# EAGLE design 7-jack-sensor-board-nano (EAGLE 9.6.2)
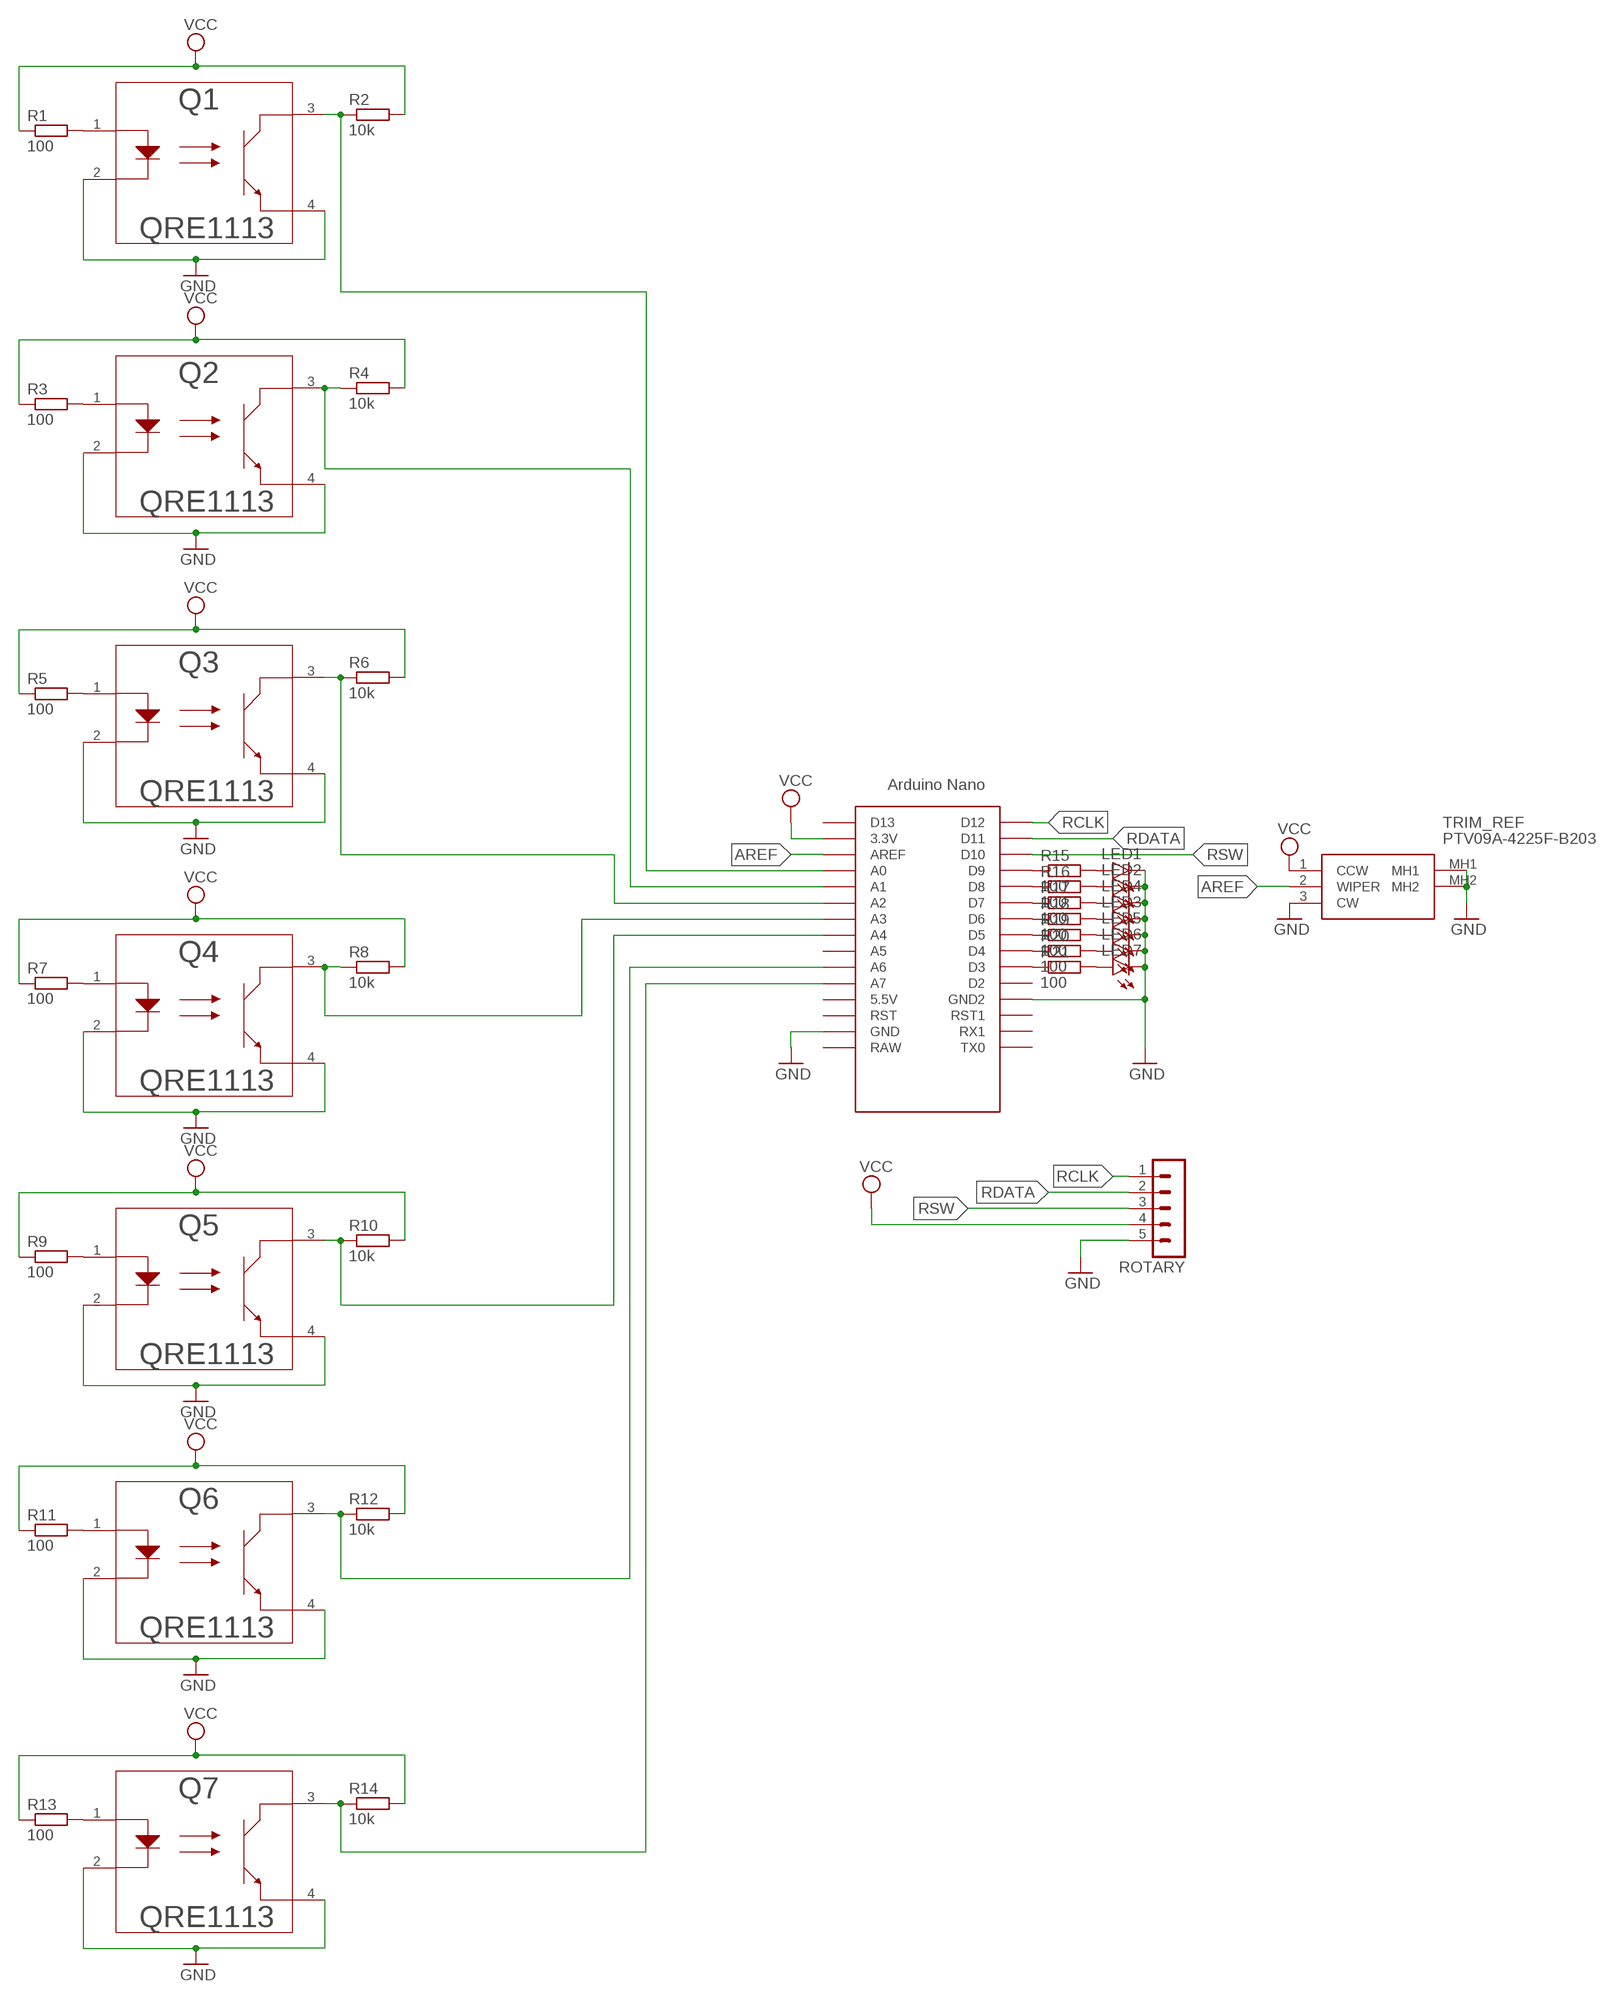
[diagram p0: schematic, sheet 1]

## Parts
LED1  LED3MM  [LED3MM]
LED2  LED3MM  [LED3MM]
LED3  LED3MM  [LED3MM]
LED4  LED3MM  [LED3MM]
LED5  LED3MM  [LED3MM]
LED6  LED3MM  [LED3MM]
LED7  LED3MM  [LED3MM]
Q1  QRE1113  [DIP4_100AQ_ONS]
Q2  QRE1113  [DIP4_100AQ_ONS]
Q3  QRE1113  [DIP4_100AQ_ONS]
Q4  QRE1113  [DIP4_100AQ_ONS]
Q5  QRE1113  [DIP4_100AQ_ONS]
Q6  QRE1113  [DIP4_100AQ_ONS]
Q7  QRE1113  [DIP4_100AQ_ONS]
R1  100  R-EU_0207/10  [0207/10]
R2  10k  R-EU_0207/10  [0207/10]
R3  100  R-EU_0207/10  [0207/10]
R4  10k  R-EU_0207/10  [0207/10]
R5  100  R-EU_0207/10  [0207/10]
R6  10k  R-EU_0207/10  [0207/10]
R7  100  R-EU_0207/10  [0207/10]
R8  10k  R-EU_0207/10  [0207/10]
R9  100  R-EU_0207/10  [0207/10]
R10  10k  R-EU_0207/10  [0207/10]
R11  100  R-EU_0207/10  [0207/10]
R12  10k  R-EU_0207/10  [0207/10]
R13  100  R-EU_0207/10  [0207/10]
R14  10k  R-EU_0207/10  [0207/10]
R15  100  R-EU_0207/10  [0207/10]
R16  100  R-EU_0207/10  [0207/10]
R17  100  R-EU_0207/10  [0207/10]
R18  100  R-EU_0207/10  [0207/10]
R19  100  R-EU_0207/10  [0207/10]
R20  100  R-EU_0207/10  [0207/10]
R21  100  R-EU_0207/10  [0207/10]
ROTARY  MA05-1  [MA05-1]
TRIM_REF  PTV09A-4225F-B203  [PTV09A4225FB203]
U$1  NANO  [NANO]

## Nets
AREF: TRIM_REF.2(WIPER) U$1.AREF
GND: LED1.K(C) LED2.K(C) LED3.K(C) LED4.K(C) LED5.K(C) LED6.K(C) LED7.K(C) Q1.2 Q1.4 Q2.2 Q2.4 Q3.2 Q3.4 Q4.2 Q4.4 Q5.2 Q5.4 Q6.2 Q6.4 Q7.2 Q7.4 ROTARY.5 TRIM_REF.3(CW) TRIM_REF.MH1 TRIM_REF.MH2 U$1.GND U$1.GND1(GND2)
N$1: Q1.1 R1.2
N$2: Q1.3 R2.1 U$1.A0
N$3: Q2.1 R3.2
N$4: Q2.3 R4.1 U$1.A1
N$5: Q3.1 R5.2
N$6: Q3.3 R6.1 U$1.A2
N$7: Q4.1 R7.2
N$8: Q4.3 R8.1 U$1.A3
N$9: Q5.1 R9.2
N$10: Q5.3 R10.1 U$1.A4
N$11: Q6.1 R11.2
N$12: Q6.3 R12.1 U$1.A6
N$13: Q7.1 R13.2
N$14: Q7.3 R14.1 U$1.A7
N$15: R15.1 U$1.D9
N$16: R16.1 U$1.D8
N$17: R17.1 U$1.D7
N$18: R18.1 U$1.D6
N$19: R19.1 U$1.D5
N$20: R20.1 U$1.D4
N$21: R21.1 U$1.D3
N$22: LED1.A R15.2
N$23: LED2.A R16.2
N$24: LED3.A R18.2
N$25: LED4.A R17.2
N$26: LED5.A R19.2
N$27: LED6.A R20.2
N$28: LED7.A R21.2
RCLK: ROTARY.1 U$1.D12
RDATA: ROTARY.2 U$1.D11
RSW: ROTARY.3 U$1.D10
VCC: R1.1 R2.2 R3.1 R4.2 R5.1 R6.2 R7.1 R8.2 R9.1 R10.2 R11.1 R12.2 R13.1 R14.2 ROTARY.4 TRIM_REF.1(CCW) U$1.3.3V
Unconnected: U$1.5V(5.5V) U$1.A5 U$1.D2 U$1.D13 U$1.ICSP1 U$1.ICSP2 U$1.ICSP3 U$1.ICSP4 U$1.ICSP5 U$1.ICSP6 U$1.RAW U$1.RST U$1.RST1 U$1.RX1 U$1.TX0

## Library data of the parts
LED1-LED7 = led:LED: LED OSRAM: - CHIPLED LG R971, LG N971, LY N971, LG Q971, LY Q971, LO R971, LY R971 LH N974, LH R974 LS Q976, LO Q976, LY Q976 LO Q996 - Hyper CHIPLED LW Q18S LB Q993, LB Q99A, LB R99A - SideLED LS A670, LO A670, LY A670, LG A670, LP A670 LB A673, LV A673, LT A673, LW A673 LH A674 LY A675 LS A676, LA A676, LO A676, LY A676, LW A676 LS A679, LY A679, LG A679 - Hyper Micro SIDELED® LS Y876, LA Y876, LO Y876, LY Y876 LT Y87S - SmartLED LW L88C, LW L88S LB L89C, LB L89S, LG L890 LS L89K, LO L89K, LY L89K LS L896, LA L896, LO L896, LY L896 - TOPLED LS T670, LO T670, LY T670, LG T670, LP T670 LSG T670, LSP T670, LSY T670, LOP T670, LYG T670 LG T671, LOG T671, LSG T671 LB T673, LV T673, LT T673, LW T673 LH T674 LS T676, LA T676, LO T676, LY T676, LB T676, LH T676, LSB T676, LW T676 LB T67C, LV T67C, LT T67C, LS T67K, LO T67K, LY T67K, LW E67C LS E67B, LA E67B, LO E67B, LY E67B, LB E67C, LV E67C, LT E67C LW T67C LS T679, LY T679, LG T679 LS T770, LO T770, LY T770, LG T770, LP T770 LB T773, LV T773, LT T773, LW T773 LH T774 LS E675, LA E675, LY E675, LS T675 LS T776, LA T776, LO T776, LY T776, LB T776 LHGB T686 LT T68C, LB T68C - Hyper Mini TOPLED® LB M676 - Mini TOPLED Santana® LG M470 LS M47K, LO M47K, LY M47K Source: http://www.osram.convergy.de LUXEON: - LUMILED® LXK2-PW12-R00, LXK2-PW12-S00, LXK2-PW14-U00, LXK2-PW14-V00 LXK2-PM12-R00, LXK2-PM12-S00, LXK2-PM14-U00 LXK2-PE12-Q00, LXK2-PE12-R00, LXK2-PE12-S00, LXK2-PE14-T00, LXK2-PE14-U00 LXK2-PB12-K00, LXK2-PB12-L00, LXK2-PB12-M00, LXK2-PB14-N00, LXK2-PB14-P00, LXK2-PB14-Q00 LXK2-PR12-L00, LXK2-PR12-M00, LXK2-PR14-Q00, LXK2-PR14-R00 LXK2-PD12-Q00, LXK2-PD12-R00, LXK2-PD12-S00 LXK2-PH12-R00, LXK2-PH12-S00 LXK2-PL12-P00, LXK2-PL12-Q00, LXK2-PL12-R00 Source: www.luxeon.com KINGBRIGHT: KA-3528ASYC Source: www.kingbright.com
Q1-Q7 = qre1113:QRE1113; COPYRIGHT: Copyright (C) 2024 Ultra Librarian. All rights reserved.; MANUFACTURER_PART_NUMBER: QRE1113; MFR_NAME: onsemi
R1-R21 = rcl:R-EU_: RESISTOR, European symbol; SPICEPREFIX: R
ROTARY = con-lstb:MA05-1: PIN HEADER; OC_FARNELL: unknown; OC_NEWARK: unknown
TRIM_REF = PTV09A-4225F-B203:PTV09A-4225F-B203: Potentiometers 20K 20% 9MM CARBON POT Source: Datasheet <https://www.bourns.com/docs/Product-Datasheets/PTV09.pdf>; ARROW_PART_NUMBER: PTV09A-4225F-B203; ARROW_PRICE-STOCK: https://www.arrow.com/en/products/ptv09a-4225f-b203/bourns?region=nac; DESCRIPTION: Potentiometers 20K 20% 9MM CARBON POT; HEIGHT: 25.5mm; MANUFACTURER_NAME: Bourns; MANUFACTURER_PART_NUMBER: PTV09A-4225F-B203; MOUSER_PART_NUMBER: 652-PTV09A-4225FB203; MOUSER_PRICE-STOCK: https://www.mouser.co.uk/ProductDetail/Bourns/PTV09A-4225F-B203?qs=Qzws7J6gxqyY5BTaAqzbXg%3D%3D
U$1 = Arduino-clone:NANO: Arduino Nano

## Board
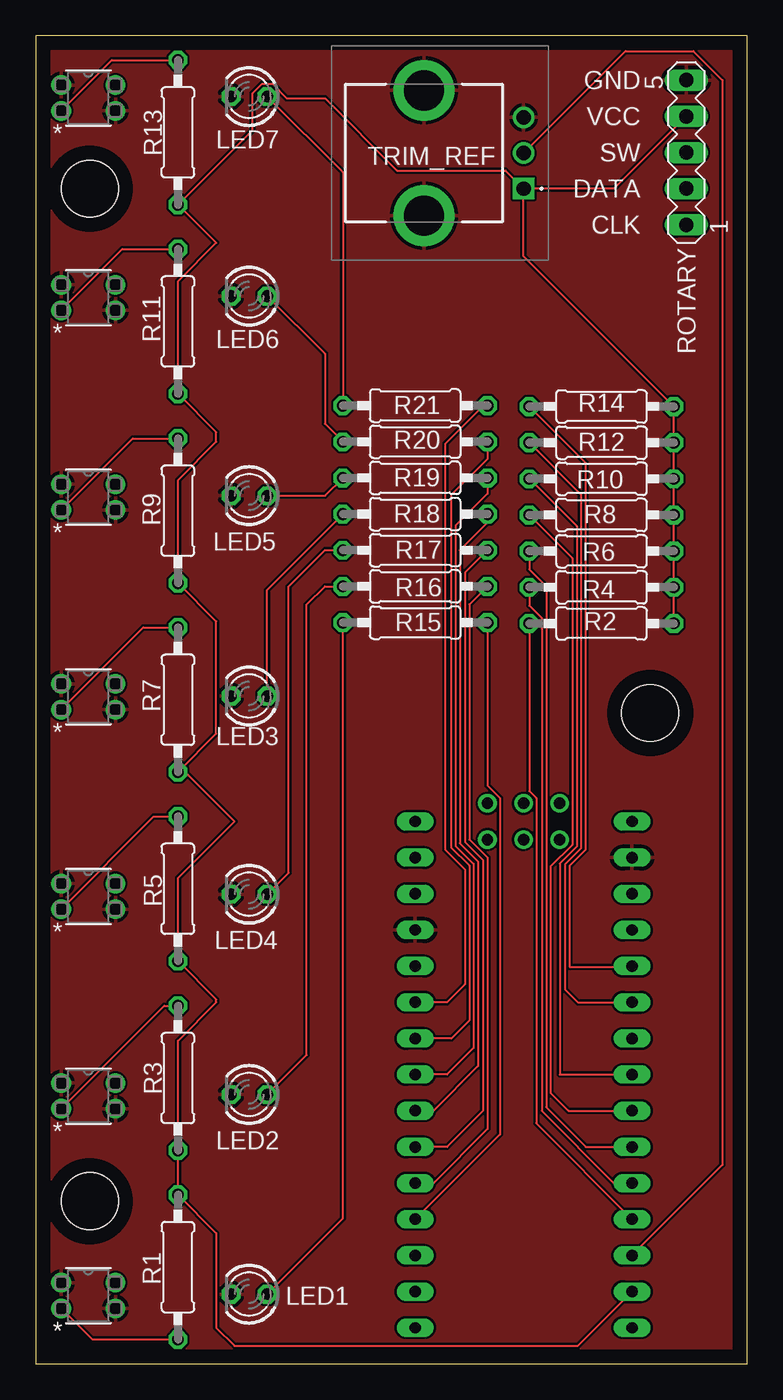
[diagram p1: board, top side]
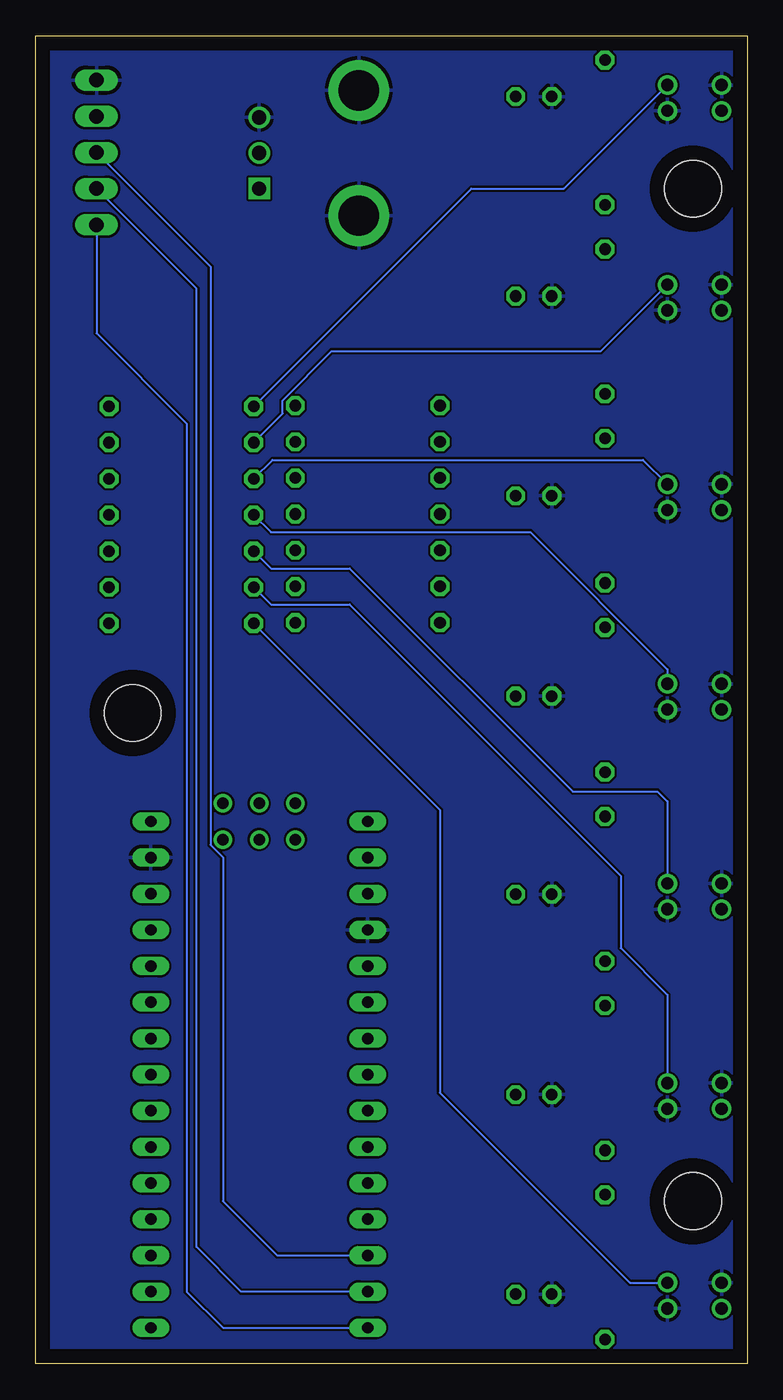
[diagram p2: board, bottom side, seen from below]

Size 50 x 93.3 mm. Coordinates in mm from the lower left corner, seen from the top.
Outline: 0,0 50,0 50,93.3 0,93.3 0,0
Copper layers (1*16): Top 0.035mm / dielectric 1.5mm / Bottom 0.035mm
Design rules "default": minimum track width 6mil, minimum drill 0.35mm, track to track 6mil, track to pad 6mil, pad to pad 6mil, via to via 6mil, smd to smd 6mil, copper to edge 40mil, drill to drill 6mil, minimum pad ring 10mil, minimum via ring 8mil, stop-mask expansion 4mil, vias tented up to drill 0mil, thermal gap 10mil
Holes 4 mm at 3.81,82.55 3.81,11.43 43.18,45.72

### Footprints (pad centres in the part's own frame; a part is rotated, then mirrored left to right if it is on the bottom)
LED3MM = drill 0.813 octagon: A -1.27,0; K 1.27,0
DIP4_100AQ_ONS = drill 0.864 pad 1.372: 1 0,0; 2 3.81,0; 3 3.81,1.803; 4 0,1.803
0207/10 = drill 0.813 octagon: 1 -5.08,0; 2 5.08,0
MA05-1 = drill 1.016 long: 1 -5.08,0; 2 -2.54,0; 3 0,0; 4 2.54,0; 5 5.08,0
PTV09A4225FB203 = drill 1 pad 1.5 square: 1 0,0 | drill 1 pad 1.5: 2 2.5,0; 3 5,0 | drill 2.84 pad 4.26: MH1 -1.9,7; MH2 6.9,7
NANO = drill 0.8 long: 3.3V -10.16,24.13; 5V -10.16,-1.27; A0 -10.16,19.05; A1 -10.16,16.51; A2 -10.16,13.97; A3 -10.16,11.43; A4 -10.16,8.89; A5 -10.16,6.35; A6 -10.16,3.81; A7 -10.16,1.27; AREF -10.16,21.59; D2 5.08,1.27; D3 5.08,3.81; D4 5.08,6.35; D5 5.08,8.89; D6 5.08,11.43; D7 5.08,13.97; D8 5.08,16.51; D9 5.08,19.05; D10 5.08,21.59; D11 5.08,24.13; D12 5.08,26.67; D13 -10.16,26.67; GND -10.16,-6.35; GND1 5.08,-1.27; RAW -10.16,-8.89; RST -10.16,-3.81; RST1 5.08,-3.81; RX1 5.08,-6.35; TX0 5.08,-8.89 | drill 0.8: ICSP1 -5.08,-10.16; ICSP2 -5.08,-7.62; ICSP3 -2.54,-10.16; ICSP4 -2.54,-7.62; ICSP5 0,-10.16; ICSP6 0,-7.62

### Placement (x,y rotation side)
LED1  15,4.9 180 top
LED2  15,18.92 180 top
LED3  15,46.91 180 top
LED4  15,32.99 180 top
LED5  15,60.98 180 top
LED6  15,75 180 top
LED7  15,89.02 180 top
Q1  1.8,3.9 0 top
Q2  1.8,17.92 0 top
Q3  1.8,31.94 0 top
Q4  1.8,45.96 0 top
Q5  1.8,59.98 0 top
Q6  1.8,74 0 top
Q7  1.8,88.02 0 top
R1  10,6.8 270 top
R2  39.76,52.01 0 top
R3  10,20.08 90 top
R4  39.76,54.55 0 top
R5  10,33.37 90 top
R6  39.76,57.09 0 top
R7  10,46.65 90 top
R8  39.76,59.63 0 top
R9  10,59.93 90 top
R10  39.76,62.17 0 top
R11  10,73.22 90 top
R12  39.76,64.71 0 top
R13  10,86.5 90 top
R14  39.76,67.25 0 top
R15  26.67,52.07 180 top
R16  26.67,54.61 180 top
R17  26.67,57.15 180 top
R18  26.67,59.69 180 top
R19  26.67,62.23 180 top
R20  26.67,64.77 180 top
R21  26.67,67.31 180 top
ROTARY  45.72,85.09 90 top
TRIM_REF  34.29,82.55 90 top
U$1  31.75,29.21 180 top

### Tracks (layer width: path | path; a pad name or v marks a point on that pad's centre or on a via)
AREF
  Top 0.152: TRIM_REF.2 41.45,92.21 46.22,92.21 48.26,90.17 48.26,13.97 U$1.AREF
GND
  pour Top: 50.1,93.3 50.1,0 0.1,0 0.1,93.3
  pour Bottom: 0,0 49.9,0 50,0.1 50,93.4 0.2,93.4 0.1,93.3 0.1,0.1
N$1
  Top 0.152: Q1.1 3.98,1.72 R1.2
N$2
  Top 0.152: R2.1 34.68,40.23 35.17,39.74 35.17,16.9 U$1.A0
  Bottom 0.152: R2.1 21.59,38.92 21.59,19.05 8.24,5.7 Q1.3
N$3
  Top 0.152: Q2.1 9.04,25.16 R3.2
N$4
  Top 0.152: R4.1 34.68,53.27 35.57,52.38 35.57,51.64 35.56,51.63 35.56,17.78 40.64,12.7 U$1.A1
  Bottom 0.152: R4.1 33.47,53.34 27.94,53.34 8.89,34.29 8.89,29.21 5.61,25.93 Q2.3
N$5
  Top 0.152: Q3.1 8.31,38.45 R5.2
N$6
  Top 0.152: R6.1 34.68,55.81 35.87,54.61 35.87,18.03 38.66,15.24 U$1.A2
  Bottom 0.152: R6.1 33.47,55.88 27.94,55.88 12.26,40.2 6.3,40.2 5.61,39.51 Q3.3
N$7
  Top 0.152: Q4.1 7.57,51.73 R7.2
N$8
  Top 0.152: R8.1 37.71,56.6 37.71,36.46 36.18,34.93 36.18,19.05 37.45,17.78 U$1.A3
  Bottom 0.152: R8.1 33.47,58.42 15.24,58.42 5.61,48.79 Q4.3
N$9
  Top 0.152: Q5.1 6.83,65.01 R9.2
N$10
  Top 0.152: R10.1 38.02,58.83 38.02,36.34 36.83,35.15 36.83,20.32 U$1.A4
  Bottom 0.152: R10.1 33.35,63.5 7.33,63.5 Q5.3
N$11
  Top 0.152: Q6.1 6.1,78.3 R11.2
N$12
  Top 0.152: R12.1 38.32,61.07 38.32,36.21 37.2,35.09 37.2,26.3 38.1,25.4 U$1.A6
  Bottom 0.152: R12.1 32.64,66.75 32.64,67.68 29.2,71.12 10.29,71.12 Q6.3
N$13
  Top 0.152: Q7.1 5.36,91.58 R13.2
N$14
  Top 0.152: R14.1 38.63,63.3 38.63,36.09 37.51,34.96 37.51,27.9 41.87,27.9 U$1.A7
  Bottom 0.152: R14.1 19.38,82.55 12.88,82.55 Q7.3
N$15
  Top 0.152: R15.1 31.75,40.62 32.63,39.74 32.63,16.12 U$1.D9
N$16
  Top 0.152: R16.1 30.48,53.34 30.48,36.83 31.75,35.56 31.75,16.51 27.94,12.7 U$1.D8
N$17
  Top 0.152: R17.1 30.18,55.58 30.18,36.66 31.45,35.4 31.45,17.78 28.91,15.24 U$1.D7
N$18
  Top 0.152: R18.1 31.75,59.09 29.81,57.15 29.81,36.56 31.08,35.29 31.08,20.92 27.94,17.78 U$1.D6
N$19
  Top 0.152: R19.1 31.75,61.13 29.5,58.88 29.5,36.4 30.77,35.12 30.77,22.19 28.91,20.32 U$1.D5
N$20
  Top 0.152: R20.1 31.75,63.57 29.2,61.02 29.2,36.27 30.47,35 30.47,24.12 29.21,22.86 U$1.D4
N$21
  Top 0.152: U$1.D3 28.9,25.4 30.17,26.67 30.17,34.73 28.81,36.09 28.81,64.65 31.47,67.31 R21.1
N$22
  Top 0.152: LED1.A 21.59,10.22 R15.2
N$23
  Top 0.152: LED2.A 19.05,21.7 19.05,53.34 20.32,54.61 R16.2
N$24
  Top 0.152: LED3.A 16.27,54.37 R18.2
N$25
  Top 0.152: LED4.A 17.78,34.5 17.78,54.61 20.32,57.15 R17.2
N$26
  Top 0.152: LED5.A 20.34,60.98 R19.2
N$27
  Top 0.152: LED6.A 20.32,70.95 20.32,66.04 R20.2
N$28
  Top 0.152: LED7.A 21.59,83.7 R21.2
RCLK
  Bottom 0.152: ROTARY.1 45.72,72.39 39.37,66.04 39.37,5.08 36.83,2.54 U$1.D12
RDATA
  Bottom 0.152: U$1.D11 35.56,5.08 38.7,8.22 38.7,75.53 ROTARY.2
RSW
  Bottom 0.152: ROTARY.3 37.71,77.08 37.71,36.46 36.83,35.58 36.83,11.43 33.02,7.62 U$1.D10
VCC
  Top 0.152: R2.2 R4.2 R6.2 R8.2 R10.2 R12.2 R14.2 34.29,77.8 TRIM_REF.1 | ROTARY.4 40.64,82.55 TRIM_REF.1 | TRIM_REF.1 33.02,83.82 25.4,83.82 20.32,88.9 17.65,88.9 16.64,89.91 15.9,89.91 15.24,89.25 15.24,86.66 R13.1 10.02,81.42 12.7,78.74 10,76.04 R11.1 12.7,65.44 12.7,64.77 10,62.07 R9.1 12.7,52.15 12.7,44.27 R7.1 10.5,41.57 13.97,38.1 10,34.13 R5.1 12.7,25.59 12.7,25.4 10,22.7 R3.1 R1.1 12.7,9.18 12.7,2.54 13.97,1.27 38.1,1.27 U$1.3.3V

### Text on the board
tNames: GND | VCC | SW | DATA | CLK